# EasyEDA Pro project ProProject_P1_2024-06-12.epro, board PCB4
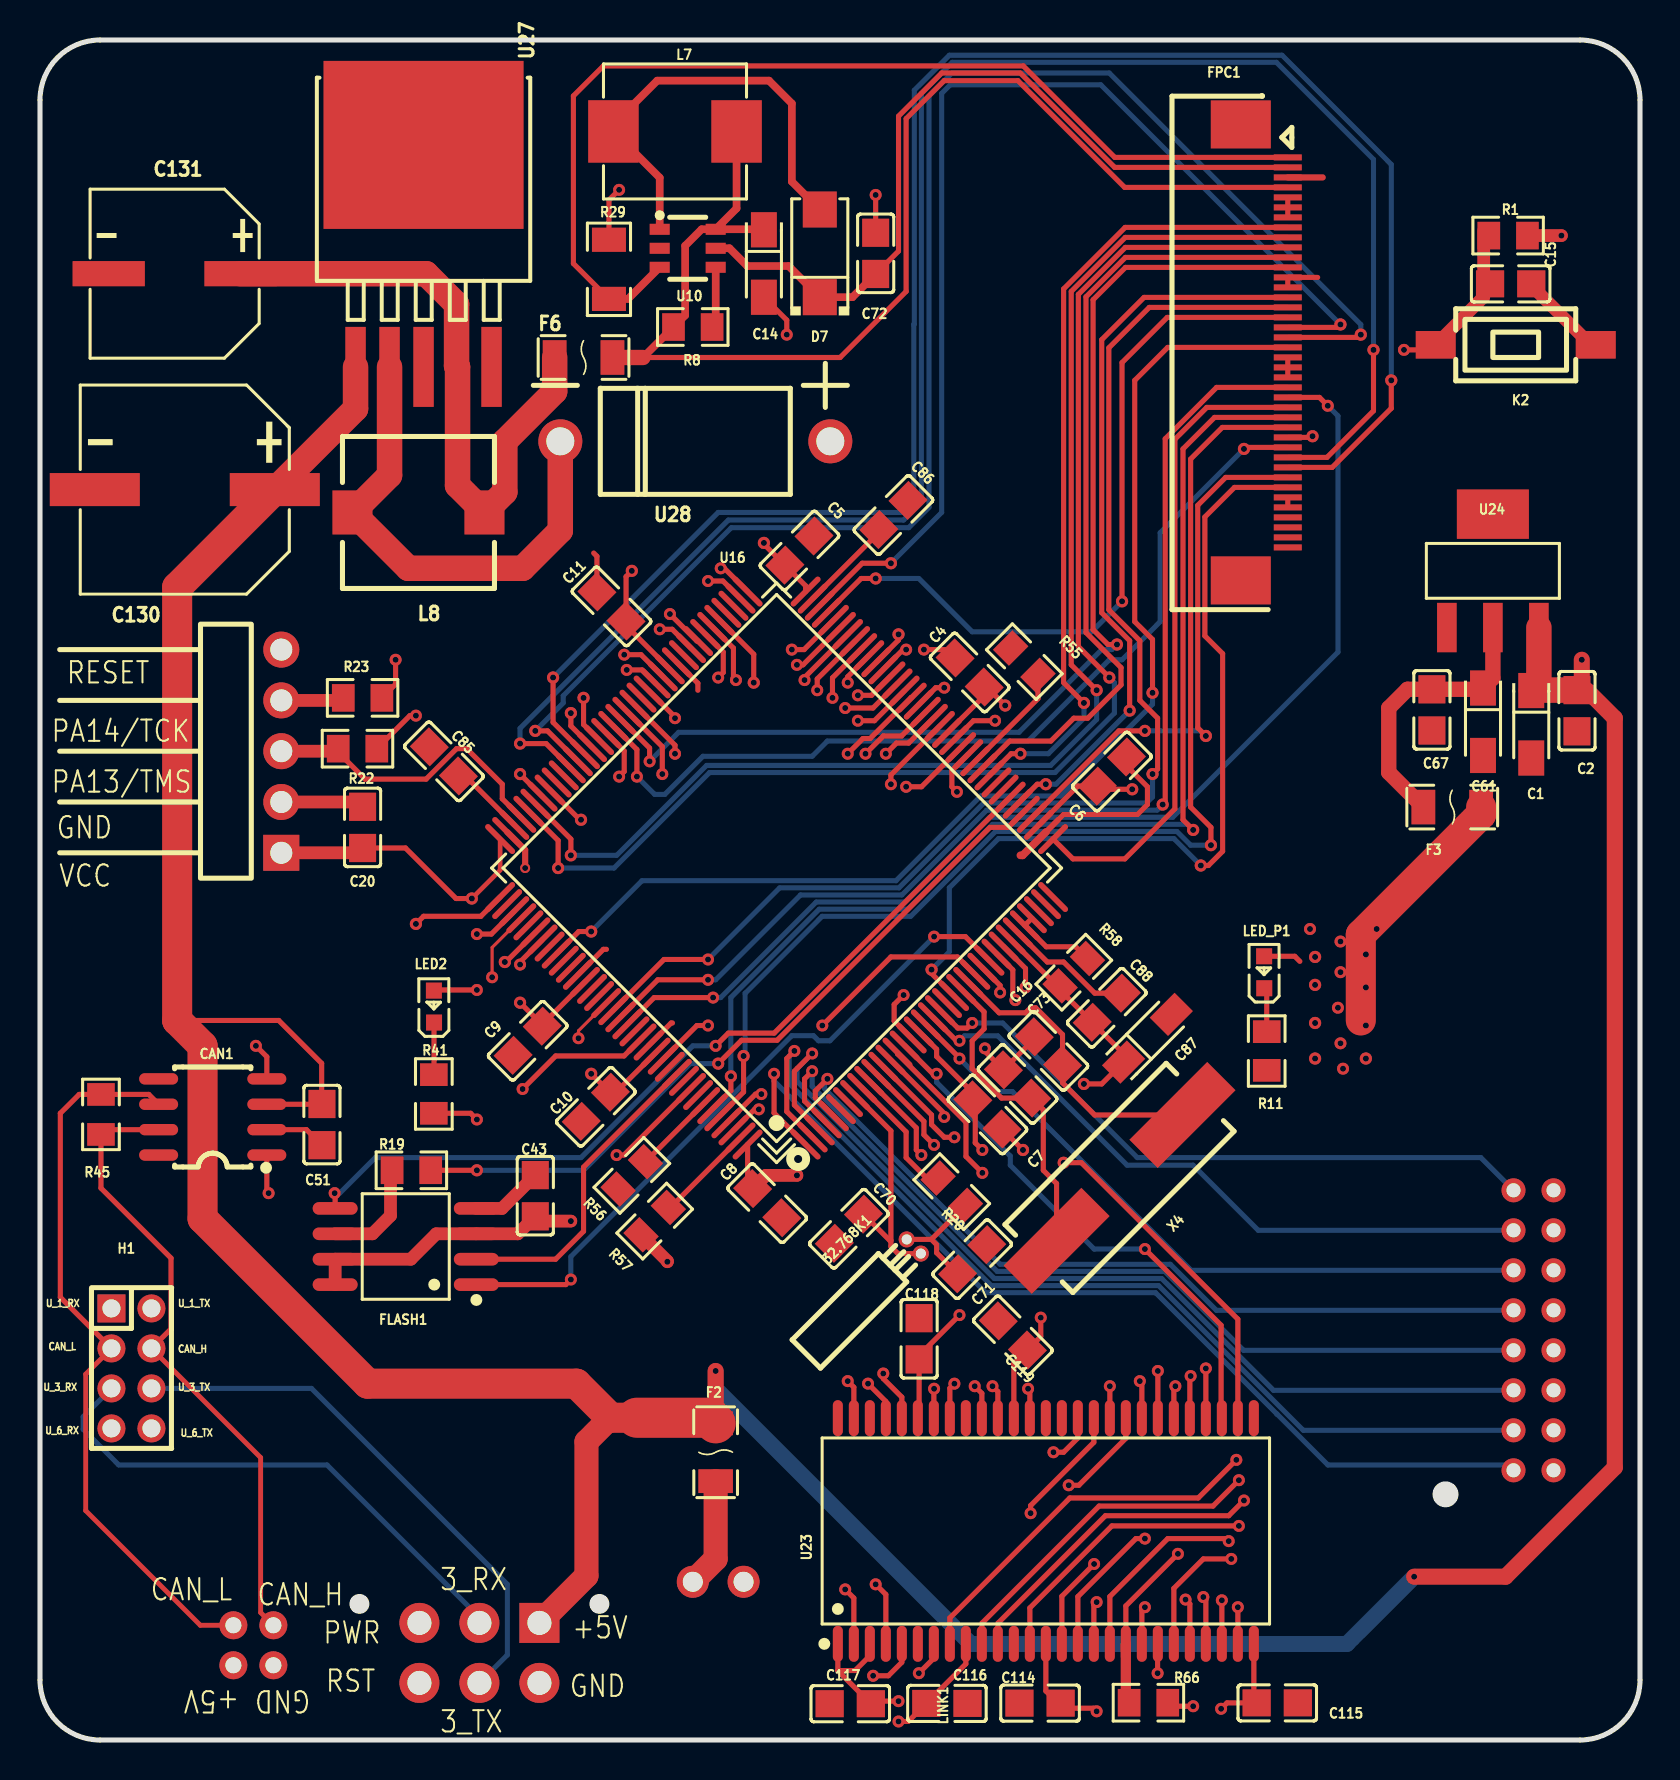
[diagram p3: board, top side]
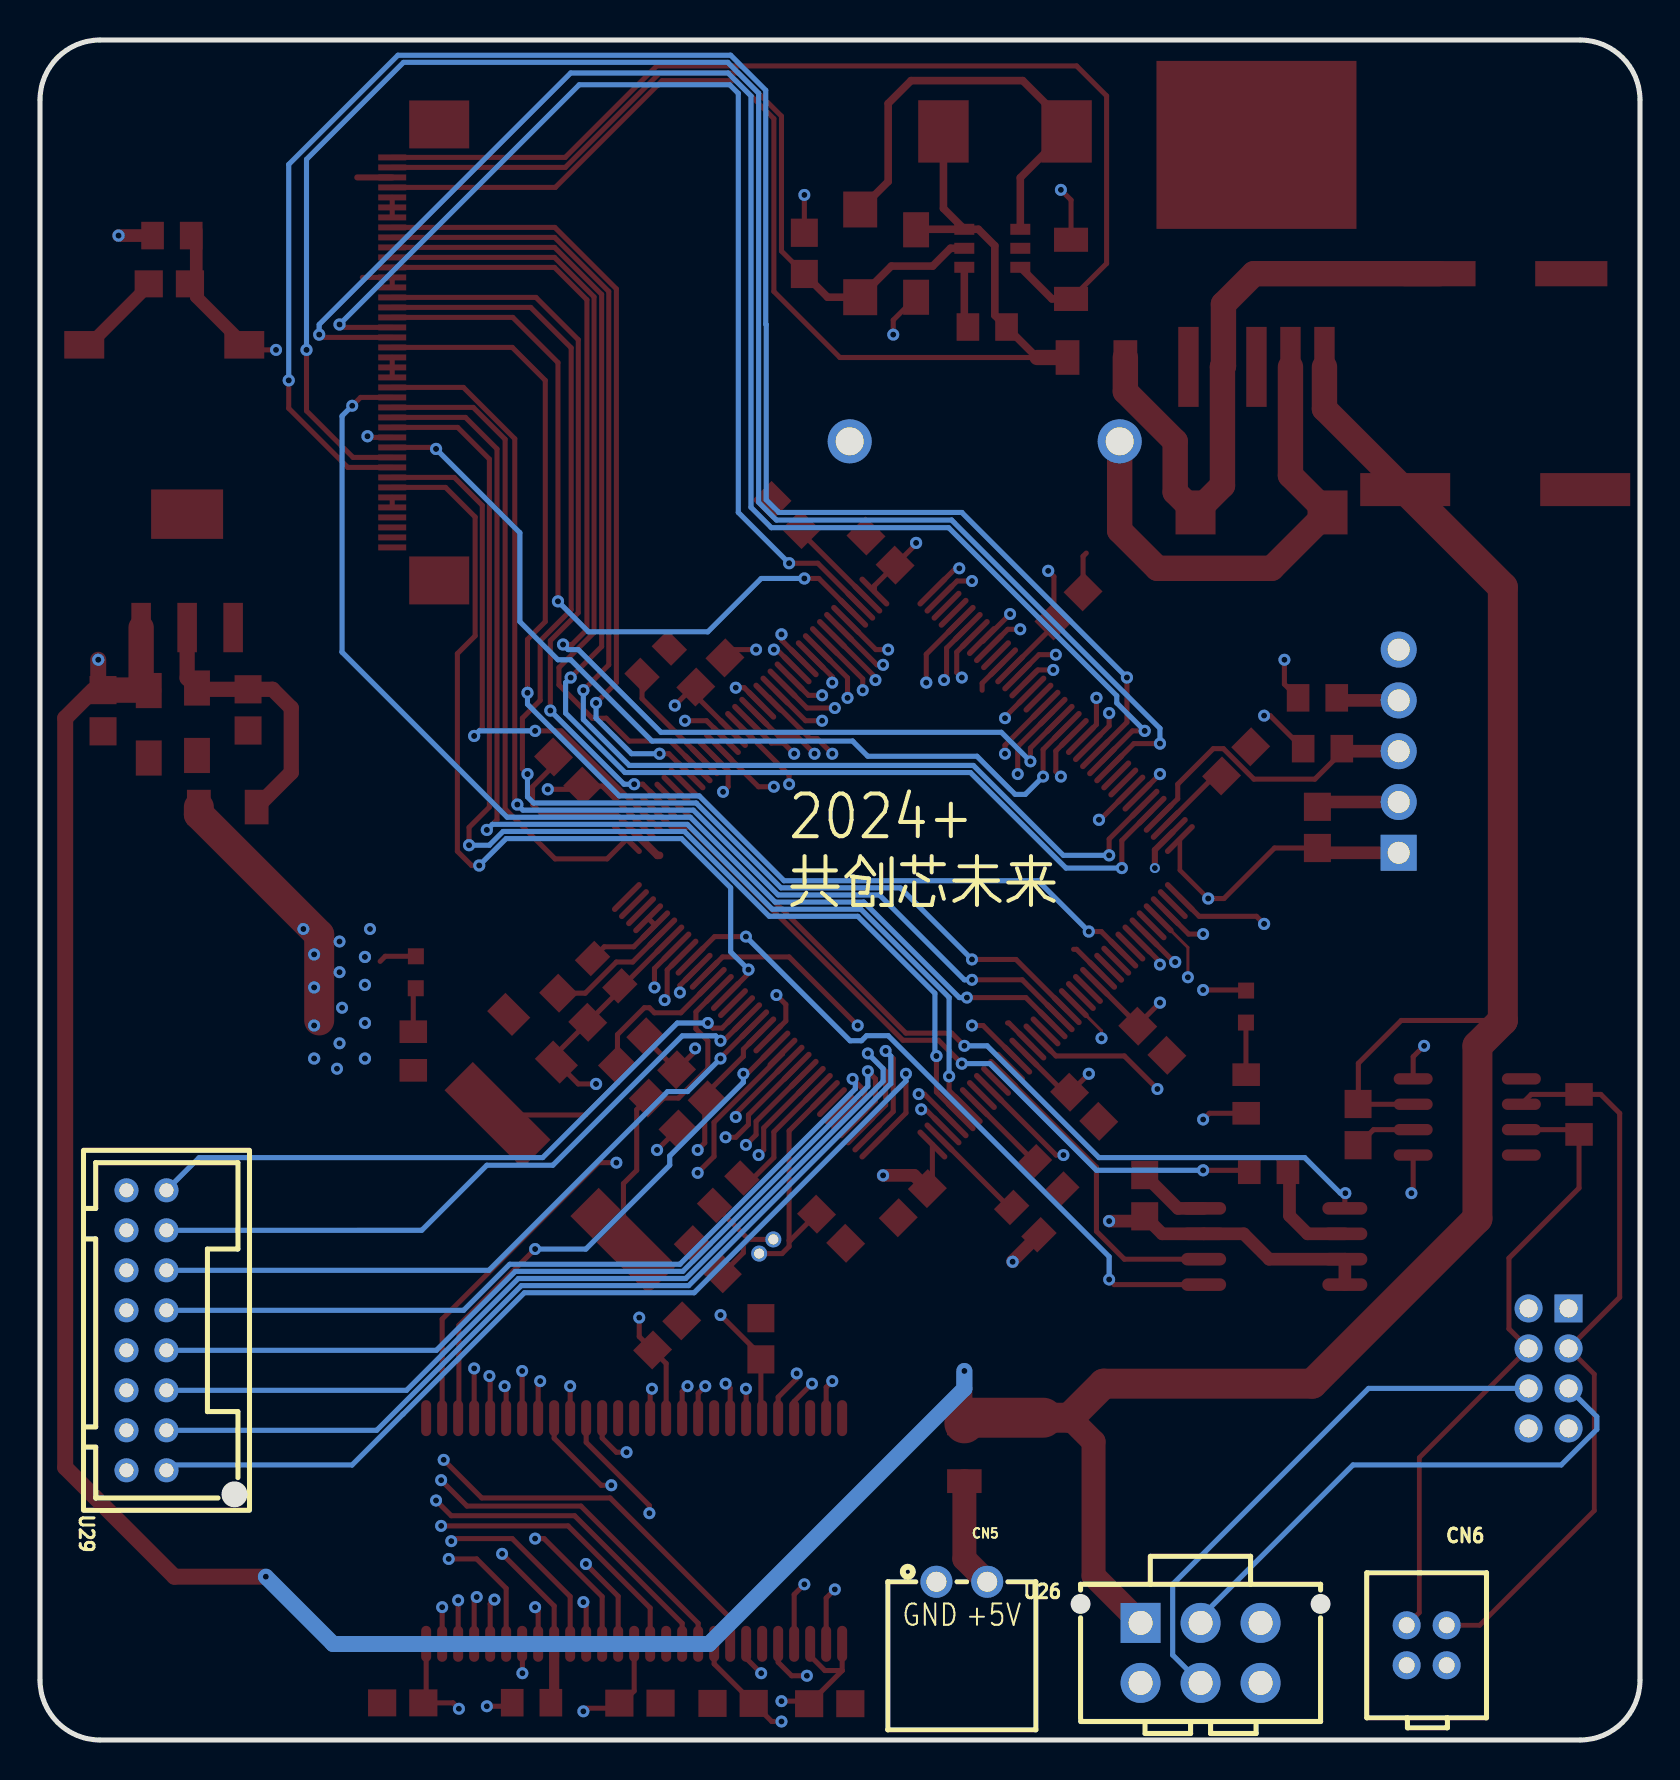
[diagram p4: board, bottom side, seen from below]

Outline 80 x 85 mm; copper layers: Top Layer, Inner1, Inner2, Bottom Layer. Coordinates in mm from the lower left corner of the outline.
Outline path: 0,82 0,3 arc(0.88,0.88) 3,0 77,0 arc(79.12,0.88) 80,3 80,82 arc(79.12,84.12) 77,85 3,85 arc(0.88,84.12) 0,82
Stack: Top Layer 0.035mm 外层铜厚1oz / Dielectric1 0.2104mm 7628 RC49% 8.6mil / Inner1 0.0152mm 内层铜厚 / Dielectric2 1.065mm 1.1mm H/HOZ 含铜 / Inner2 0.0152mm 内层铜厚 / Dielectric3 0.2104mm 7628 RC49% 8.6mil / Bottom Layer 0.035mm 外层铜厚1oz

## Design rules (mm)
template: JLCPCB Capability(Two Layers Board)
spacing copperThickness1oz (default): track to track 0.102, other pairs 0.152 to 0.3
spacing copperThickness2oz: track to track 0.203, other pairs 0.152 to 0.3
track width copperThickness1oz (default): min 0.127, default 0.254, max 2.54
track width copperThickness2oz: min 0.203, default 0.254, max 2.54
differential pair differentialPair (default): width min 0.127, default 0.254, max 2.54; gap min 0.152, default 0.152
via viaSize (default): diameter min 0.5, default 0.61, max 10; hole min 0.3, default 0.305, max 6.3

## Placement (name value [footprint] x y rotation side)
32.768K1  32.768kHz  [OSC-TH_BD2.0-P0.70-D0.3]  43.69 24.67 45 top
C1  10uF  [CAP-SMD_L3.2-W1.6-RD]  74.56 50.79 270 top
C2  100nF  [C0805]  76.85 51.46 90 top
C4  100nF  [C0805]  46.48 53.38 315 top
C5  100nF  [C0805]  37.97 59.47 225 top
C6  100nF  [C0805]  53.59 48.42 225 top
C7  100nF  [C0805]  47.37 31.28 135 top
C8  100nF  [C0805]  36.36 26.84 135 top
C9  100nF  [C0805]  24.38 34.96 45 top
C10  100nF  [C0805]  27.79 31.66 45 top
C11  100nF  [C0805]  28.58 56.68 315 top
C14  10uF  [CAP-SMD_L3.2-W1.6-RD]  36.19 73.82 270 top
C15  100nF  [C0805]  73.53 72.81 180 top
C16  22pF  [c0805#2]  50.42 34.45 135 top
C20  100nF  [C0805]  16.13 45.63 90 top
C43  100nF  [C0805]  24.77 27.22 90 top
C51  100nF  [C0805]  14.1 30.77 270 top
C61  10uF  [CAP-SMD_L3.2-W1.6-RD]  72.15 50.91 270 top
C67  100nF  [C0805]  69.6 51.51 90 top
C70  12pF  [C0805]  40.45 25.56 225 top
C71  12pF  [C0805]  46.61 24.04 45 top
C72  1uF  [C0805]  41.78 74.33 90 top
C73  22pF  [C0805#2]  48.88 32.8 135 top
C85  22uF  [C0805]  20.19 48.93 135 top
C86  22uF  [C0805]  42.67 61.25 45 top
C87  10uF  [CAP-SMD_L3.2-W1.6-RD]  55.37 35.09 45 top
C88  100nF  [C0805]  53.34 36.61 225 top
C114  100nF  [C0805]  50 1.84 0 top
C115  100nF  [C0805]  61.86 1.86 180 top
C116  100nF  [c0805]  45.35 1.83 180 top
C117  100nF  [C0805]  40.51 1.81 0 top
C118  100nF  [C0805]  43.96 20.06 270 top
C119  100nF  [C0805]  48.64 20.23 315 top
C130  680uF  [CAP-SMD_BD10.0-L10.3-W10.3-LS10.9-FD]  7.24 62.52 180 top
C131  220uF  [CAP-SMD_BD8.0-L8.3-W8.3-RD]  6.73 73.32 0 top
CAN1  TJA1050T/CM,118  [soic-8_l5.0-w4.0-p1.27-ls6.0-bl]  8.64 31.15 90 top
CN5  XH-2AW  [CONN-TH_XH-2AW_C2908611]  33.91 7.91 180 bottom
CN6  PHB-2*2A  [CONN-TH_PHB-2-2A]  10.67 4.74 180 bottom
D7  SS16  [SMA_L4.4-W2.6-LS5.0-RD]  38.99 74.33 90 top
F2  BSMD1206-200-12V  [F1206]  33.78 14.39 90 top
F3  BSMD1206-100-24V  [F1206]  70.61 46.65 0 top
F6  BSMD1206-100-24V  [F1206]  27.18 69.12 0 top
FLASH1  W25Q128JVSIQ  [SOIC-8_L5.3-W5.3-P1.27-LS8.0-BL]  18.29 24.67 90 top
FPC1  F0501-B-40-20T-R  [FPC-SMD_40P-P0.50_L4.4-W25.6]  61.21 69.38 270 top
H1  PZ200-2-04-Z  [HDR-TH_8P-P2.00-V-M-R2-C4-S2.00]  4.57 18.58 270 top
K2  RESET_KEY  [SW-SMD_L6.1-W3.6-LS8.0]  73.79 69.76 0 top
L7  22uH  [IND-SMD_L7.3-W6.6_MHCI06030]  31.75 80.43 0 top
L8  10uH  [IND-SMD_L7.6-W7.6]  18.92 61.38 180 top
LED2  NCD0603W1  [LED0603-RD]  19.7 36.67 90 top
LED_P1  NCD0603W1  [LED0603-RD]  61.21 38.39 90 top
LINK1  五线下载电路  [HDR-TH_5P-P2.54-H-M-W10.0-N]  12.07 49.44 90 top
R1  10kΩ  [R0805]  73.41 75.22 0 top
R8  10kΩ  [R0805]  32.64 70.65 0 top
R11  510  [R0805]  61.34 34.45 270 top
R19  22R  [R0805]  18.57 28.48 0 top
R20  1kΩ  [R0805]  45.59 27.42 135 top
R22  10kΩ  [R0805]  15.88 49.57 180 top
R23  10kΩ  [R0805]  16.13 52.11 180 top
R29  7.5Ω  [R1206]  28.45 73.53 270 top
R41  510  [R0805]  19.69 32.3 270 top
R45  120Ω  [R0805#2]  3.05 31.28 270 top
R55  10kΩ  [R0805]  49.22 53.92 315 top
R56  10kΩ  [R0805]  29.59 28.23 225 top
R57  0Ω  [R0805]  30.73 25.94 45 top
R58  0Ω  [R0805]  51.69 38.39 45 top
R66  10kΩ  [R0805]  55.42 1.87 180 top
U10  -  [SOT-23-6_L2.9-W1.6-P0.95-LS2.8-BR]  32.39 74.59 180 top
U16  STM32F429ZGT6  [LQFP-144_L20.0-W20.0-P0.50-LS22.0-BL]  36.83 43.6 45 top
U23  W9825G6KH-6  [TSOP-54_L22.2-W10.2-P0.80-LS11.8-BL]  50.29 10.45 0 top
U24  AMS1117-3.3  [SOT-223-4_L6.5-W3.5-P2.30-LS7.0-BR]  72.64 58.46 270 top
U26  ZX-MX3.0-2-3PZZ  [CONN-TH_6P-P3.00_HC-MX3.0-2X3A]  21.97 4.35 180 bottom
U27  LM2575S-3.3  [TO-263-5_L10.0-W8.4-P1.70-LS15.3-BR]  19.18 74.2 270 top
U28  1N5824  [DO-201AD_BD5.3-L9.5-P13.50-D1.4-RD]  32.77 64.93 0 top
U29  B16B-PUDSS-1(LF)(SN)  [CONN-TH_B16B-PUDSS-1]  74.68 20.48 90 bottom
X4  8MHz  [CRYSTAL-SMD_L11.5-W4.8-LS12.7]  53.97 28.1 45 top

## Footprints (pads in the part's own frame, mm; a bottom-side part is the same pattern mirrored in y, then rotated)
c0805
  rect 1.41x1.35 smd: 1(-1.03,0) 2(1.03,0)
c0805#2
  rect 1.41x1.35 smd: 1(-1,0) 2(1,0)
C0805
  rect 1.41x1.35 smd: 1(-1.03,0) 2(1.03,0)
C0805#2
  rect 1.41x1.35 smd: 1(-1,0) 2(1,0)
CAP-SMD_BD8.0-L8.3-W8.3-RD
  rect 3.61x1.26 smd: 1(3.295,0) 2(-3.295,0)
CAP-SMD_BD10.0-L10.3-W10.3-LS10.9-FD
  rect 4.5x1.65 smd: 1(-4.5,0) 2(4.5,0)
CAP-SMD_L3.2-W1.6-RD
  rect 1.758x1.296 smd: 1(-1.687,0) 2(1.687,0)
CONN-TH_6P-P3.00_HC-MX3.0-2X3A
  rect 2x2 hole 1.2: 1(-3,1.5)
  round 2 hole 1.2: 2(-3,-1.5) 3(0,1.5) 4(0,-1.5) 5(3,1.5) 6(3,-1.5)
CONN-TH_B16B-PUDSS-1
  round 1.2 hole 0.7: 1(7,-1) 2(7,1) 3(5,-1) 4(5,1) 5(3,-1) 6(3,1) 7(1,-1) 8(1,1) 9(-1,-1) 10(-1,1) 11(-3,-1) 12(-3,1) 13(-5,-1) 14(-5,1) 15(-7,-1) 16(-7,1)
CONN-TH_PHB-2-2A
  round 1.4 hole 0.8: 1(1,-1) 2(1,1) 3(-1,-1) 4(-1,1)
CONN-TH_XH-2AW_C2908611
  round 1.6 hole 1: 1(-1.27,0) 2(1.27,0)
CRYSTAL-SMD_L11.5-W4.8-LS12.7
  rect 5.499x1.999 smd: 1(-4.45,0) 2(4.45,0)
DO-201AD_BD5.3-L9.5-P13.50-D1.4-RD
  round 2.2 hole 1.4: 1(-6.75,0) 2(6.75,0)
F1206
  rect 1.19x1.728 smd: 1(-1.445,0) 2(1.445,0)
FPC-SMD_40P-P0.50_L4.4-W25.6
  rect 2.4x3 smd: 0(-11.4,-1.175) 0(11.4,-1.175)
  rect 0.3x1.4 smd: 1(-9.75,1.175) 2(-9.25,1.175) 3(-8.75,1.175) 4(-8.25,1.175) 5(-7.75,1.175) 6(-7.25,1.175) 7(-6.75,1.175) 8(-6.25,1.175) 9(-5.75,1.175) 10(-5.25,1.175) 11(-4.75,1.175) 12(-4.25,1.175) 13(-3.75,1.175) 14(-3.25,1.175) 15(-2.75,1.175) 16(-2.25,1.175) 17(-1.75,1.175) 18(-1.25,1.175) 19(-0.75,1.175) 20(-0.25,1.175) 21(0.25,1.175) 22(0.75,1.175) 23(1.25,1.175) 24(1.75,1.175) 25(2.25,1.175) 26(2.75,1.175) 27(3.25,1.175) 28(3.75,1.175) 29(4.25,1.175) 30(4.75,1.175) 31(5.25,1.175) 32(5.75,1.175) 33(6.25,1.175) 34(6.75,1.175) 35(7.25,1.175) 36(7.75,1.175) 37(8.25,1.175) 38(8.75,1.175) 39(9.25,1.175) 40(9.75,1.175)
HDR-TH_5P-P2.54-H-M-W10.0-N
  rect 1.8x1.8 hole 1.1: 1(-5.08,0)
  round 1.8 hole 1.1: 2(-2.54,0) 3(0,0) 4(2.54,0) 5(5.08,0)
HDR-TH_8P-P2.00-V-M-R2-C4-S2.00
  rect 1.4x1.4 hole 0.9: 1(-3,-1)
  round 1.4 hole 0.9: 2(-3,1) 3(-1,-1) 4(-1,1) 5(1,-1) 6(1,1) 7(3,-1) 8(3,1)
IND-SMD_L7.3-W6.6_MHCI06030
  rect 2.524x3.12 smd: 1(-3.078,0) 2(3.078,0)
IND-SMD_L7.6-W7.6
  rect 2x2.2 smd: 1(-3.3,0) 2(3.3,0)
LED0603-RD
  rect 0.8x0.8 smd: 1(-0.799,-0.004) 2(0.799,0.004)
LQFP-144_L20.0-W20.0-P0.50-LS22.0-BL
  oval 0.28x2 smd: 1(-8.75,-10.8) 2(-8.25,-10.8) 3(-7.75,-10.8) 4(-7.25,-10.8) 5(-6.75,-10.8) 6(-6.25,-10.8) 7(-5.75,-10.8) 8(-5.25,-10.8) 9(-4.75,-10.8) 10(-4.25,-10.8) 11(-3.75,-10.8) 12(-3.25,-10.8) 13(-2.75,-10.8) 14(-2.25,-10.8) 15(-1.75,-10.8) 16(-1.25,-10.8) 17(-0.75,-10.8) 18(-0.25,-10.8) 19(0.25,-10.8) 20(0.75,-10.8) 21(1.25,-10.8) 22(1.75,-10.8) 23(2.25,-10.8) 24(2.75,-10.8) 25(3.25,-10.8) 26(3.75,-10.8) 27(4.25,-10.8) 28(4.75,-10.8) 29(5.25,-10.8) 30(5.75,-10.8) 31(6.25,-10.8) 32(6.75,-10.8) 33(7.25,-10.8) 34(7.75,-10.8) 35(8.25,-10.8) 36(8.75,-10.8) 73(8.75,10.8) 74(8.25,10.8) 75(7.75,10.8) 76(7.25,10.8) 77(6.75,10.8) 78(6.25,10.8) 79(5.75,10.8) 80(5.25,10.8) 81(4.75,10.8) 82(4.25,10.8) 83(3.75,10.8) 84(3.25,10.8) 85(2.75,10.8) 86(2.25,10.8) 87(1.75,10.8) 88(1.25,10.8) 89(0.75,10.8) 90(0.25,10.8) 91(-0.25,10.8) 92(-0.75,10.8) 93(-1.25,10.8) 94(-1.75,10.8) 95(-2.25,10.8) 96(-2.75,10.8) 97(-3.25,10.8) 98(-3.75,10.8) 99(-4.25,10.8) 100(-4.75,10.8) 101(-5.25,10.8) 102(-5.75,10.8) 103(-6.25,10.8) 104(-6.75,10.8) 105(-7.25,10.8) 106(-7.75,10.8) 107(-8.25,10.8) 108(-8.75,10.8)
  oval 2x0.28 smd: 37(10.8,-8.75) 38(10.8,-8.25) 39(10.8,-7.75) 40(10.8,-7.25) 41(10.8,-6.75) 42(10.8,-6.25) 43(10.8,-5.75) 44(10.8,-5.25) 45(10.8,-4.75) 46(10.8,-4.25) 47(10.8,-3.75) 48(10.8,-3.25) 49(10.8,-2.75) 50(10.8,-2.25) 51(10.8,-1.75) 52(10.8,-1.25) 53(10.8,-0.75) 54(10.8,-0.25) 55(10.8,0.25) 56(10.8,0.75) 57(10.8,1.25) 58(10.8,1.75) 59(10.8,2.25) 60(10.8,2.75) 61(10.8,3.25) 62(10.8,3.75) 63(10.8,4.25) 64(10.8,4.75) 65(10.8,5.25) 66(10.8,5.75) 67(10.8,6.25) 68(10.8,6.75) 69(10.8,7.25) 70(10.8,7.75) 71(10.8,8.25) 72(10.8,8.75) 109(-10.8,8.75) 110(-10.8,8.25) 111(-10.8,7.75) 112(-10.8,7.25) 113(-10.8,6.75) 114(-10.8,6.25) 115(-10.8,5.75) 116(-10.8,5.25) 117(-10.8,4.75) 118(-10.8,4.25) 119(-10.8,3.75) 120(-10.8,3.25) 121(-10.8,2.75) 122(-10.8,2.25) 123(-10.8,1.75) 124(-10.8,1.25) 125(-10.8,0.75) 126(-10.8,0.25) 127(-10.8,-0.25) 128(-10.8,-0.75) 129(-10.8,-1.25) 130(-10.8,-1.75) 131(-10.8,-2.25) 132(-10.8,-2.75) 133(-10.8,-3.25) 134(-10.8,-3.75) 135(-10.8,-4.25) 136(-10.8,-4.75) 137(-10.8,-5.25) 138(-10.8,-5.75) 139(-10.8,-6.25) 140(-10.8,-6.75) 141(-10.8,-7.25) 142(-10.8,-7.75) 143(-10.8,-8.25) 144(-10.8,-8.75)
OSC-TH_BD2.0-P0.70-D0.3
  round 0.8 hole 0.5: 1(0,0.5) 2(0,-0.5)
R0805
  rect 1.133x1.377 smd: 1(-0.966,0) 2(0.966,0)
R0805#2
  rect 1.133x1.377 smd: 1(-1,0) 2(1,0)
R1206
  rect 1.208x1.701 smd: 1(-1.479,0) 2(1.479,0)
SMA_L4.4-W2.6-LS5.0-RD
  rect 1.8x1.7 smd: 1(-2.192,0) 2(2.192,0)
soic-8_l5.0-w4.0-p1.27-ls6.0-bl
  oval 0.569x1.95 smd: 1(-1.905,-2.705) 2(-0.635,-2.705) 3(0.635,-2.705) 4(1.905,-2.705) 5(1.905,2.705) 6(0.635,2.705) 7(-0.635,2.705) 8(-1.905,2.705)
SOIC-8_L5.3-W5.3-P1.27-LS8.0-BL
  oval 0.63x2.25 smd: 1(-1.905,-3.53) 2(-0.635,-3.53) 3(0.635,-3.53) 4(1.905,-3.53) 5(1.905,3.53) 6(0.635,3.53) 7(-0.635,3.53) 8(-1.905,3.53)
SOT-23-6_L2.9-W1.6-P0.95-LS2.8-BR
  rect 1x0.55 smd: 1(1.4,-0.95) 2(1.4,0) 3(1.4,0.95) 4(-1.4,0.95) 5(-1.4,0) 6(-1.4,-0.95)
SOT-223-4_L6.5-W3.5-P2.30-LS7.0-BR
  rect 2.47x0.98 smd: 1(2.835,-2.3) 2(2.835,0) 3(2.835,2.3)
  rect 2.47x3.6 smd: 4(-2.835,0)
SW-SMD_L6.1-W3.6-LS8.0
  rect 1.999x1.379 smd: 1(-4,0) 2(4,0)
TO-263-5_L10.0-W8.4-P1.70-LS15.3-BR
  rect 4x1.02 smd: 1(5.55,-3.4) 2(5.55,-1.7) 3(5.55,0) 4(5.55,1.7) 5(5.55,3.4)
  rect 8.4x10 smd: 6(-5.55,0)
TSOP-54_L22.2-W10.2-P0.80-LS11.8-BL
  oval 0.5x1.8 smd: 1(-10.4,-5.642) 2(-9.6,-5.642) 3(-8.8,-5.642) 4(-8,-5.642) 5(-7.2,-5.642) 6(-6.4,-5.642) 7(-5.6,-5.642) 8(-4.8,-5.642) 9(-4,-5.642) 10(-3.2,-5.642) 11(-2.4,-5.642) 12(-1.6,-5.642) 13(-0.8,-5.642) 14(0,-5.642) 15(0.8,-5.642) 16(1.6,-5.642) 17(2.4,-5.642) 18(3.2,-5.642) 19(4,-5.642) 20(4.8,-5.642) 21(5.6,-5.642) 22(6.4,-5.642) 23(7.2,-5.642) 24(8,-5.642) 25(8.8,-5.642) 26(9.6,-5.642) 27(10.4,-5.642) 28(10.4,5.642) 29(9.6,5.642) 30(8.8,5.642) 31(8,5.642) 32(7.2,5.642) 33(6.4,5.642) 34(5.6,5.642) 35(4.8,5.642) 36(4,5.642) 37(3.2,5.642) 38(2.4,5.642) 39(1.6,5.642) 40(0.8,5.642) 41(0,5.642) 42(-0.8,5.642) 43(-1.6,5.642) 44(-2.4,5.642) 45(-3.2,5.642) 46(-4,5.642) 47(-4.8,5.642) 48(-5.6,5.642) 49(-6.4,5.642) 50(-7.2,5.642) 51(-8,5.642) 52(-8.8,5.642) 53(-9.6,5.642) 54(-10.4,5.642)

## Nets
As in the schematic.

Pads without a net: CAN1 5; U16 6 7 21 34 35 36 44 45 75 76 82 88 99 100 110 113 116 118 119 122 123 128 133 135 137; U23 40; U24 4

## Via types
v1: diameter 0.6, hole 0.3, Top Layer to Bottom Layer, 136 vias
v2: diameter 0.61, hole 0.305, Top Layer to Bottom Layer, 65 vias
v3: diameter 0.5, hole 0.3, Top Layer to Bottom Layer, 1 via

## Routing (per net, layer and track width the routed paths; a pad name or vN(x,y) marks a point on that pad's centre or on a via; arc(x,y) is an arc through that point)
+5V: length 232.4
  Top Layer w0.254: CAN1.3 14.08,31.79 ; 14.08,31.79 14.08,33.83 11.94,35.98 6.89,35.98 6.87,35.96 ; 14.08,31.79 C51.1
  Top Layer w0.8: v1(68.71,8.16) 73.28,8.16 78.74,13.63 78.74,51.09 77.34,52.49 ; C2.2 77.09,52.73 v2(77.09,54.01) ; v1(33.78,18.45) F2.2
  Top Layer w1.2: 28.52,16.11 27.32,14.91 27.32,8.21 U26.1
  Top Layer w1.27: C2.2 74.94,52.49 ; 74.94,52.49 74.94,52.5 U24.3 ; 74.94,52.49 74.58,52.49 C1.1 ; C130.1 15.78,66.56 U27.1
  Top Layer w1.5: C130.1 6.86,57.64 6.86,35.98 8.13,34.71 8.13,26.07 16.38,17.82 26.82,17.82 28.52,16.11 29.84,16.11
  Top Layer w2: 29.84,16.11 33.5,16.11 F2.2
  Inner2 w1: CN6.1 8.87,3.74 7.75,4.86 7.75,9.56 9.4,11.21 19.61,11.21 U26.1
  Bottom Layer w0.8: v1(68.71,8.16) 65.34,4.8 46.54,4.8 33.78,17.56 v1(33.78,18.45)
GND: length 72.2
  Top Layer w0.254: v1(47.24,34.58) 47.24,34.44 48.17,33.51 49.71,35.05 49.71,35.16 ; C6.1 54.32,48.71 55.37,47.66 55.37,46.77 54.88,46.28 51.18,46.28 U16.38 ; v2(49.15,29.5) C7.1 ; U16.83 32.89,52.84 32.89,52.49 ; FPC1.21 FPC1.22 FPC1.23 ; v1(47.75,50.96) 46.67,50.96 U16.51 ; FPC1.14 62.39,73.08 62.41,73.1 FPC1.13 63.88,73.13 ; U16.120 28.17,39.53 28.32,39.53 ; v1(43.18,37.25) 42.71,36.78 42.71,35.95 U16.16 ; v2(27.18,52.11) 27.18,50.78 U16.94 ; U16.61 43.16,54.52 v1(43.31,54.52) ; 41.66,77.25 41.78,77.13 C72.2 ; v1(28.96,77.51) 28.45,77 R29.1 ; FPC1.5 FPC1.6 FPC1.7 ; C88.1 52.74,37.34 51.18,38.9 50.37,38.9 48.89,40.38 ; C14.2 37.34,70.99 v1(37.34,70.27) ; FPC1.35 FPC1.36 ; v1(44.2,54.52) 45.34,54.52 C4.1 ; v2(63.63,65.19) 63.57,65.13 FPC1.29 ; CAN1.2 13.32,30.52 C51.2 ; C11.1 27.85,59.19 27.69,59.35 ; 31.62,35.85 31.56,35.85 U16.130
  Top Layer w0.305: FPC1.3 64.14,78.13 ; v3(24.26,43.6) 24.26,44.5 U16.107
  Top Layer w0.381: 49.02,44.23 49.13,44.23 U16.38
  Top Layer w0.635: 77.66,69.63 74.56,72.73 C15.1 ; C43.2 23.1,26.58 FLASH1.4 ; C20.2 15.89,46.9 LINK1.2
  vias: v1(41.78,77.25)
VCC: length 185.8
  Top Layer w0.229: 23.01,45.05 23.01,43.49 v2(21.59,42.07)
  Top Layer w0.254: U23.27 60.69,2.12 60.96,1.86 59.35,1.86 v1(59.06,1.56) ; v1(18.8,51.22) 18.49,51.22 R22.1 ; v2(26.54,51.34) 26.54,50.7 27.6,49.64 ; U23.1 39.89,3.47 ; 39.89,3.47 40.76,3.47 41.49,4.21 41.49,4.81 ; 39.89,3.47 39.89,3.47 C117.2 41.67,1.94 v1(42.93,1.94) ; R23.1 17.78,52.79 v1(17.78,54.01) ; 29.18,55.63 29.12,55.57 29.12,55.44 ; 29.18,55.63 29.3,55.76 C11.2 29.3,58.17 v2(29.59,58.46) ; 29.18,55.63 29.18,55.5 29.12,55.44 ; v2(27.56,33.31) 28.42,32.45 28.74,32.45 ; v1(57.66,1.69) 56.89,1.69 56.71,1.87 R66.1 ; U16.121 25.09,35.75 ; 25.09,35.75 25.11,35.73 C9.2 ; 25.09,35.75 25.09,35.78 v2(24,36.87) ; 28.74,32.45 28.86,32.45 30.78,34.37 ; 28.74,32.45 28.74,32.39 C10.2 ; U16.72 38.28,57.71 C5.2 36.19,59.79 v2(36.19,59.85) ; LED2.2 19.73,37.5 v1(21.84,37.5) ; U16.17 44.83,34.54 44.83,34.18 46.76,32.25 46.76,29.86 v1(47.12,29.5) ; U16.62 42.93,55 v2(42.93,55.28) ; U23.43 48.69,18.82 C119.2 50.04,20.17 v1(50.04,21.12) ; U16.39 51.89,47.7 C6.2 53.03,47.53 v2(54.61,47.53) ; U16.84 29.58,55.44 29.12,55.44 ; v1(45.97,21.25) 43.96,19.23 C118.2 43.96,16.16 U23.49 ; U16.52 47.21,52.21 C4.2 47.34,52.65 v2(48.26,51.73) ; U23.14 50.29,2.45 51.15,1.59 52.68,1.59 v1(52.83,1.43) ; U23.9 46.29,3.81 C116.2 43.41,0.93 v1(42.93,0.93) ; v2(52.2,32.8) 53.09,32.8 C87.1 54.18,34.32 C88.2 51.01,37.49 51.01,37.71 50.85,37.71 U16.30 ; C20.1 18.27,44.6 20.8,42.07 v2(21.59,42.07) ; 35.38,29.77 35.38,27.82 35.63,27.57 ; 62.99,38.93 62.74,39.19 LED_P1.2
  Top Layer w0.635: 35.63,27.57 36.29,28.23 v2(37.85,28.23) ; R57.1 31.37,23.94 v2(31.37,23.91) ; FLASH1.8 FLASH1.7 18.54,24.04 19.81,25.31 FLASH1.3 23.89,25.31 C43.1 25,25.94 v2(26.54,25.94) ; LINK1.1 15.89,44.36 C20.1 ; v2(76.07,75.22) R1.2
  Top Layer w1.5: 66.04,35.98 66.04,40.27 72.06,46.29 F3.2
  Inner2 w0.254: 67.31,39.79 76.07,48.55 v2(76.07,75.22)
  vias: v1(63.5,40.55) v1(64.9,36.61) v1(65.02,39.92) v1(65.02,38.39) v1(65.02,34.83) v1(65.15,33.56) v1(66.83,40.55) v2(63.75,39.15) v2(63.75,37.76) v2(63.75,35.85) v2(63.75,34.07) v2(66.29,39.28) v2(66.29,37.63) v2(66.29,35.72) v2(66.29,34.07)
VCC_LCD: length 62.8
  Top Layer w0.254: FPC1.4 54.23,77.63 48.9,82.97 45.21,82.97 43.31,81.07 43.31,72.43 40,69.12 30.15,69.12
  Top Layer w0.381: U10.6 36.17,75.54 C14.1 ; U10.6 34.83,76.58 L7.2 ; U10.6 33.08,75.54 32.26,74.71 32.26,71.23 R8.1 30.15,69.12
  Top Layer w0.762: F6.2 30.15,69.12
VDDA: length 4.3
  Top Layer w0.254: U16.33 49.24,40.73 50.31,39.66 51.79,39.66 52.37,39.07
CAN2_RX: length 40
  Top Layer w0.254: v1(10.8,34.71) 11.34,34.16 CAN1.4 ; U16.73 34.22,58.58 v1(34.04,58.58)
  Inner1 w0.254: v1(34.04,58.58) 33.15,58.58 32,57.44 28.64,57.44 10.42,39.22 10.42,35.08 v1(10.8,34.71)
CAN2_TX: length 45.8
  Top Layer w0.254: CAN1.1 11.34,27.43 v1(11.43,27.34) ; U16.74 34.15,57.95 v1(33.4,57.95)
  Inner1 w0.254: v1(33.4,57.95) 32.33,56.88 28.58,56.88 11.43,39.73 v1(11.43,27.34)
CAN_H: length 31.9
  Top Layer w0.24: H1.4 11.03,14.12 11.03,6.37 CN6.4
  Top Layer w0.254: CAN1.7 3.29,30.52 R45.2 3.05,27.6 6.55,24.09 6.55,20.56 H1.4
CAN_L: length 36.7
  Top Layer w0.24: CN6.2 8.02,5.74 2.29,11.47 2.29,18.29 H1.3
  Top Layer w0.254: H1.3 1.02,22.14 1.02,31.34 1.96,32.28 R45.1 5.44,32.28 CAN1.6
FMC_A0: length 35.4
  Top Layer w0.254: 57.49,4.81 57.49,6.81 57.4,6.9 ; v1(44.07,29.25) 43.81,29.5 43.81,30.6 U16.10
  Inner1 w0.254: v1(44.07,29.25) 44.07,28.1 50.87,21.3 50.87,15.96 53.09,13.75 53.09,9.82 55.88,7.02 v1(57.28,7.02)
FMC_A1: length 36.4
  Top Layer w0.254: v1(44.7,29.75) 44.2,30.26 44.2,30.93 U16.11 ; U23.24 58.29,7.02 v1(58.17,7.15)
  Inner1 w0.254: v1(58.17,7.15) 57.71,7.6 55.8,7.6 53.44,9.96 53.44,13.9 51.23,16.11 51.23,21.45 44.7,27.98 v1(44.7,29.75)
FMC_A2: length 37.8
  Top Layer w0.254: 59.06,7.02 v1(59.09,6.98) U23.25 ; v1(45.72,30.14) 45.21,30.14 44.58,30.77 44.58,31.25 U16.12
  Inner1 w0.254: v1(45.72,30.14) 45.72,27.46 51.58,21.6 51.58,16.27 53.85,14.01 53.85,10.06 55.87,8.04 58.67,8.04 59.06,7.66 59.06,7.02
FMC_A3: length 38.3
  Top Layer w0.254: 42.52,34.02 45.21,31.33 v1(45.21,31.15) ; U23.26 v1(59.89,6.64)
  Inner1 w0.254: v1(45.21,31.15) 45.64,31.15 46.36,30.44 46.36,27.72 51.94,22.14 51.94,16.67 54.36,14.26 54.36,10.07 56.03,8.39 58.82,8.39 59.89,7.32 v1(59.89,6.64)
FMC_A4: length 28.9
  Top Layer w0.254: U23.29 59.89,21.04 52.07,28.87 v1(51.18,28.87) ; 42.88,34.37 42.88,34.31 46.3,30.88 46.3,29.18 v1(47.12,28.36)
  Inner1 w0.254: v1(47.12,28.36) 50.67,28.36 v1(51.18,28.87)
FMC_A5: length 26.8
  Top Layer w0.254: v1(44.83,33.31) 44.64,33.31 U16.15 ; U23.30 59.06,16.13 59.06,20.74 v1(55.25,24.55)
  Bottom Layer w0.254: v1(44.83,33.31) 44.83,32.88 48.51,29.2 48.51,28.74 52.71,24.55 v1(55.25,24.55)
FMC_A6: length 41.3
  Top Layer w0.254: v1(43.31,47.66) 44.08,47.66 46.06,49.64 ; U23.31 v1(58.29,18.58)
  Inner1 w0.254: v1(43.31,47.66) 43.31,46.57 58.29,31.58 v1(58.29,18.58)
FMC_A7: length 41.9
  Top Layer w0.254: 57.49,16.09 57.49,18.16 v1(57.53,18.2) ; U16.53 42.55,48.25 v1(42.55,47.79)
  Inner1 w0.254: v1(42.55,47.79) 42.55,46.83 57.53,31.84 v1(57.53,18.2)
FMC_A8: length 42.6
  Top Layer w0.254: v1(42.29,49.31) 42.82,49.85 43.43,49.85 U16.54 ; U23.33 56.69,17.61 v1(56.77,17.69)
  Inner1 w0.254: v1(42.29,49.31) 41.91,48.93 41.91,46.96 56.77,32.1 v1(56.77,17.69)
FMC_A9: length 43.5
  Top Layer w0.254: U16.55 43.08,50.2 42.16,50.2 v1(41.28,49.31) ; U23.34 v1(55.89,18.45)
  Inner1 w0.254: v1(55.89,18.45) 55.89,32.47 40.89,47.47 40.89,48.93 v1(41.28,49.31)
FMC_A10: length 59.5
  Top Layer w0.254: v1(45.21,52.61) 44.79,52.61 U16.56 ; U23.22 56.69,7.58 58.17,9.05 v1(59.56,9.05)
  Inner1 w0.254: v1(59.56,9.05) 59.92,9.05 61.82,10.95 61.82,31.69 46.61,46.9 46.61,51.22 v1(45.21,52.61)
FMC_A11: length 43.9
  Top Layer w0.254: v1(40.39,49.31) 41.15,50.08 41.51,50.08 43.55,52.12 U16.57 ; v1(54.99,17.94) 55.09,17.84 U23.35
  Inner1 w0.254: v1(40.39,49.31) 40.13,49.06 40.13,47.59 54.56,33.16 54.56,18.37 v1(54.99,17.94)
FMC_A12: length 58.9
  Top Layer w0.254: v1(51.44,12.74) 51.94,12.74 54.29,15.09 U23.36 ; U16.87 31.75,51.15 v1(31.75,51.09)
  Inner1 w0.254: v1(51.44,12.74) 51.05,13.12 41.53,13.12 38.35,16.29 38.35,26.07 32.77,31.66 32.77,50.08 v1(31.75,51.09)
FMC_BA0: length 65.4
  Top Layer w0.254: v1(31.75,49.31) 31.75,49.74 U16.89 ; v1(55.25,6.64) 55.09,6.49 U23.20
  Inner1 w0.254: v1(31.75,49.31) 32.41,48.65 32.41,31.51 38,25.92 38,15.63 41.02,12.61 50.22,12.61 51.44,11.4 51.44,7.02 52.32,6.13 54.74,6.13 v1(55.25,6.64)
FMC_BA1: length 67.5
  Top Layer w0.254: v1(31.12,48.3) 31.12,49.67 29.37,51.41 ; v1(55.88,3.34) 55.88,4.8 U23.21
  Inner1 w0.254: v1(31.12,48.3) 32.06,47.36 32.06,30.34 37.59,24.8 37.59,14.64 40.26,11.97 50.04,11.97 50.8,11.21 50.8,6.26 53.72,3.34 v1(55.88,3.34)
FMC_D0: length 57.6
  Top Layer w0.254: v1(29.21,54.27) 30.05,54.27 U16.85 ; U23.2 40.69,7.1 v1(40.26,7.53)
  Inner1 w0.254: v1(40.26,7.53) 36.45,11.34 36.45,24.16 28.96,31.66 28.96,46.84 27.94,47.85 27.94,53 v1(29.21,54.27)
FMC_D1: length 56.6
  Top Layer w0.254: U16.86 30.11,53.5 v1(29.34,53.5) ; U23.4 42.29,7.28 v1(41.78,7.78)
  Inner1 w0.254: v1(41.78,7.78) 36.8,12.76 36.8,24.31 29.34,31.78 29.34,46.96 28.32,47.98 28.32,52.49 v1(29.34,53.5)
FMC_D2: length 48.1
  Top Layer w0.254: v2(23.24,38.9) 23.29,38.9 U16.114 ; U23.5 43.09,3.89 42.42,3.21 v1(41.66,3.21)
  Inner1 w0.254: v2(23.24,38.9) 23.24,38.52 25.27,36.49 25.27,34.33 35.74,23.86 35.74,9.64 41.66,3.72 v1(41.66,3.21)
FMC_D3: length 48.2
  Top Layer w0.254: U23.7 44.69,4.09 v1(43.94,3.34) ; U16.115 24,38.9 v1(24,38.77)
  Inner1 w0.254: v1(24,38.77) 24.38,38.77 28.19,34.96 28.19,31.91 36.09,24.01 36.09,9.79 42.55,3.34 v1(43.94,3.34)
FMC_D4: length 67.9
  Top Layer w0.254: v1(40.89,50.96) 41.72,50.96 U16.58 ; v1(59.82,14.01) 57.91,12.1 51.49,12.1 45.49,6.1 45.49,4.81
  Inner1 w0.254: v1(40.89,50.96) 43.05,50.96 44.07,49.95 44.07,46.31 59.82,30.56 v1(59.82,14.01)
FMC_D5: length 68.7
  Top Layer w0.254: 42.88,52.83 41.65,51.6 v1(40.26,51.6) ; v1(59.94,12.99) 58.65,11.7 52.95,11.7 47.09,5.84 U23.10
  Inner1 w0.254: v1(59.94,12.99) 60.4,13.44 60.4,30.48 44.45,46.43 44.45,50.2 43.05,51.6 v1(40.26,51.6)
FMC_D6: length 67.8
  Top Layer w0.254: U23.11 47.89,5.84 53.27,11.21 59.44,11.21 v1(60.2,11.97) ; v1(40.89,52.23) 41.58,52.23 42.52,53.18
  Inner1 w0.254: v1(40.89,52.23) 42.93,52.23 44.81,50.35 44.81,46.58 60.75,30.63 60.75,12.53 v1(60.2,11.97)
FMC_D7: length 68.5
  Top Layer w0.254: v1(59.94,10.71) 53.59,10.71 49.49,6.6 49.49,4.81 ; v1(40.39,52.87) 40.39,53.16 41.46,54.24
  Inner1 w0.254: v1(40.39,52.87) 42.93,52.87 45.16,50.63 45.16,46.95 61.11,31 61.11,11.87 v1(59.94,10.71)
FMC_D8: length 43.7
  Top Layer w0.254: v1(49.4,17.56) 49.49,17.47 49.49,16.09 ; v1(39.62,52.11) 39.62,53.11 41.11,54.59
  Inner1 w0.254: v1(49.4,17.56) 48.57,17.56 42.44,23.69 42.44,44.68 39.62,47.5 v1(39.62,52.11)
FMC_D9: length 43.4
  Top Layer w0.254: v1(38.86,52.49) 38.86,53.05 U16.65 ; U23.44 47.89,17.42 v1(47.62,17.69)
  Inner1 w0.254: v1(47.62,17.69) 42.09,23.23 42.09,44.53 38.86,47.76 v1(38.86,52.49)
FMC_D10: length 44
  Top Layer w0.254: U16.66 38.23,53.13 v1(38.23,53) ; v1(46.74,17.69) 47.09,17.33 U23.45
  Inner1 w0.254: v1(38.23,53) 37.97,52.74 37.97,48.14 41.73,44.39 41.73,22.62 46.67,17.69 v1(46.74,17.69)
FMC_D11: length 44.6
  Top Layer w0.254: v1(37.85,53.76) 38.15,53.76 40.05,55.65 ; 45.49,16.09 45.49,17.59 v1(45.72,17.82)
  Inner1 w0.254: v1(45.72,17.82) 45.27,17.82 41.38,21.71 41.38,44.24 37.47,48.15 37.47,53.38 v1(37.85,53.76)
FMC_D12: length 44.9
  Top Layer w0.254: v1(37.59,54.52) 38.21,54.52 39.69,56.01 ; v1(44.7,17.56) 44.7,17.67 44.69,17.68 U23.48
  Inner1 w0.254: v1(44.7,17.56) 41.02,21.25 41.02,44.09 36.96,48.15 36.96,53.89 v1(37.59,54.52)
FMC_D13: length 43.9
  Top Layer w0.254: v1(42.16,18.33) 42.16,18.07 43.09,17.14 U23.50 ; v2(35.69,52.87) 35.69,54.29 33.97,56.01
  Inner1 w0.254: v1(42.16,18.33) 41.78,18.33 40.67,19.44 40.67,43.94 35.69,48.92 v2(35.69,52.87)
FMC_D14: length 43.2
  Top Layer w0.254: 42.29,16.09 42.29,16.93 v1(41.4,17.82) ; v1(34.8,53) 34.67,53.12 34.67,54.6 33.61,55.65
  Inner1 w0.254: v1(41.4,17.82) 40.31,18.91 40.31,43.8 34.8,49.31 v1(34.8,53)
FMC_D15: length 42.5
  Top Layer w0.254: v1(40.39,17.94) 40.69,17.64 U23.53 ; v1(33.91,53.12) 34.16,53.38 34.16,54.4 U16.79
  Inner1 w0.254: v1(33.91,53.12) 33.91,49.69 39.95,43.65 39.95,18.38 v1(40.39,17.94)
FMC_NBL0: length 43.1
  Top Layer w0.254: U16.141 35.78,32.3 v1(36.07,32.3) ; U23.15 51.09,7.19 v1(52.71,8.8)
  Inner1 w0.254: v1(36.07,32.3) 39.6,28.76 39.6,17.08 41.4,15.28 51.05,15.28 52.71,13.63 v1(52.71,8.8)
FMC_NBL1: length 32.7
  Top Layer w0.254: U23.39 51.89,15.1 51.18,14.39 v1(50.67,14.39) ; v1(35.94,31.53) 35.72,31.53 U16.142
  Inner1 w0.254: v1(50.67,14.39) 41.79,14.39 39.24,16.93 39.24,28.23 v1(35.94,31.53)
FMC_SDCAS: length 48.1
  Top Layer w0.254: v1(33.4,35.72) 32.84,35.72 U16.132 ; v1(52.83,6.9) 52.69,6.75 U23.17
  Inner1 w0.254: v1(52.83,6.9) 52.01,7.71 52.01,13.36 51.62,13.75 41.53,13.75 38.86,16.42 38.86,26.33 33.12,32.07 33.12,35.44 v1(33.4,35.72)
FMC_SDCKE0: length 25.8
  Top Layer w0.254: 53.49,16.09 v1(53.49,17.69) ; v1(49.28,37.63) 49.28,38.58 U16.29
  Inner1 w0.254: v1(49.28,37.63) 53.49,33.41 v1(53.49,17.69)
FMC_SDCLK: length 60
  Top Layer w0.254: U23.38 52.69,14.88 49.53,11.72 v1(49.53,11.34) ; U16.93 29.21,49.45 29.21,48.42 v1(28.96,48.17)
  Inner1 w0.254: v1(28.96,48.17) 29.84,47.28 29.84,31.77 37.16,24.46 37.16,13.55 39.37,11.34 v1(49.53,11.34)
FMC_SDNE0: length 42.6
  Top Layer w0.254: U16.28 48.64,38.5 48.64,37.12 v1(48.77,36.99) ; v1(56.9,9.31) 54.29,6.7 U23.19
  Top Layer w0.508: U23.19 54.29,1.96 54.23,1.89
  Inner1 w0.254: v1(56.9,9.31) 55.75,10.45 55.75,14.39 52.91,17.23 52.91,33.36 49.28,36.99 v1(48.77,36.99)
FMC_SDNWE: length 38.8
  Top Layer w0.254: U16.26 48.01,37.73 v1(48.01,37.38) ; U23.16 51.89,7.17 54.79,10.07 v1(55.25,10.07)
  Inner1 w0.254: v1(55.25,10.07) 55.09,10.22 55.09,14.41 52.32,17.18 52.32,31.66 48.01,35.98 v1(48.01,37.38)
FMC_SDRAS: length 57
  Top Layer w0.254: v1(45.85,47.41) 45.59,47.66 45.59,48.47 46.41,49.29 ; v1(59.44,9.94) 59.31,10.07 56.39,10.07 53.49,7.17 53.49,4.81
  Inner1 w0.254: v1(45.85,47.41) 45.85,46.9 61.46,31.28 61.46,11.41 60,9.94 v1(59.44,9.94)
INPUT1: length 32.6
  Top Layer w0.254: v1(46.61,35.85) 46.36,35.6 45.89,35.6 U16.20
  Bottom Layer w0.254: v1(46.61,35.85) 48.13,35.85 54.86,29.12 72.04,29.12 U29.1
INPUT2: length 33.9
  Top Layer w0.254: v1(45.97,34.96) 45.82,34.96 44.64,36.14
  Bottom Layer w0.254: v1(45.97,34.96) 46.22,35.21 47.89,35.21 54.36,28.74 57.66,28.74 60.91,25.48 U29.3 73.47,25.69
INPUT3: length 34.5
  Top Layer w0.254: v1(45.97,34.07) 45.97,34.1 U16.18
  Bottom Layer w0.254: v1(45.97,34.07) 47.62,32.42 48.62,32.42 57.56,23.48 U29.5
INPUT4: length 42.1
  Top Layer w0.254: U16.5 38.77,32.12 38.77,32.45 v1(39.37,33.06)
  Bottom Layer w0.254: v1(39.37,33.06) 39.23,32.92 39.23,32.56 48.01,23.79 56.52,23.79 58.82,21.48 U29.7
INPUT5: length 44.5
  Top Layer w0.254: U16.4 38.23,31.95 38.23,33.06 v1(38.61,33.44)
  Bottom Layer w0.254: U29.9 60.18,19.48 56.24,23.43 47.86,23.43 38.61,32.68 v1(38.61,33.44)
INPUT6: length 48.7
  Top Layer w0.254: v1(38.61,34.33) 37.72,33.44 37.72,31.75 U16.3
  Bottom Layer w0.254: v1(38.61,34.33) 37.85,33.56 37.85,32.94 47.71,23.08 56.08,23.08 61.67,17.48 73.68,17.48
INPUT7: length 50.2
  Top Layer w0.254: U16.2 37.34,31.42 37.34,34.07 v1(37.72,34.45)
  Bottom Layer w0.254: v1(37.72,34.45) 37.46,34.19 37.46,32.82 47.56,22.72 55.93,22.72 63.17,15.48 73.68,15.48
INPUT8: length 49.6
  Top Layer w0.254: v1(36.7,33.31) 36.7,31.35 38.28,29.77
  Bottom Layer w0.254: 73.68,13.48 73.41,13.75 64.39,13.75 61.85,16.3 61.85,16.3 55.78,22.36 47.29,22.36 36.7,32.95 v1(36.7,33.31)
LED1: length 15.1
  Top Layer w0.254: U16.136 29.2,29.25 v1(28.83,29.25) ; v1(21.84,31.03) 21.53,31.34 R41.2
  Inner1 w0.254: v1(21.84,31.03) 27.05,31.03 v1(28.83,29.25)
LEDA: length 40.2
  Top Layer w0.254: FPC1.2 53.74,78.63 49.02,83.35 45.09,83.35 42.93,81.19 42.93,74.44 C72.1
  Top Layer w0.381: C72.1 40.62,72.14 D7.1 37.43,73.7 35.36,73.7 34.48,74.59 U10.5
LEDK: length 52.3
  Top Layer w0.254: FPC1.1 53.74,79.13 49.16,83.7 28.17,83.7 26.67,82.21 26.67,73.82 28.44,72.05 R29.2
  Top Layer w0.381: U10.3 29.4,72.05 R29.2
LTDC-B5: length 32.3
  Top Layer w0.254: U16.37 51.65,44.06 54.24,44.06 56.74,46.56 56.74,65.04 58.34,66.63 FPC1.26
LTDC_B3: length 57.1
  Top Layer w0.254: v1(33.4,38.01) 30.89,38.01 29.02,36.14 ; v2(56.13,46.77) 56.26,46.9 56.26,65.06 58.83,67.63 FPC1.24
  Bottom Layer w0.254: v1(33.4,38.01) 33.78,38.01 38.02,42.25 43.09,42.25 47.34,46.49 55.85,46.49 v2(56.13,46.77)
LTDC_B4: length 57.9
  Top Layer w0.254: 29.37,35.78 30.71,37.12 v1(33.66,37.12) ; v1(64.39,66.71) 63.97,67.13 FPC1.25
  Bottom Layer w0.254: v1(64.39,66.71) 64.9,66.2 64.9,54.39 56.64,46.14 47.48,46.14 43.24,41.9 38.81,41.9 34.04,37.12 v1(33.66,37.12)
LTDC_B6: length 57.9
  Top Layer w0.254: v2(34.54,33.18) 34.54,32.47 U16.139 ; FPC1.27 58.73,66.13 57.15,64.55 57.15,46.01 v2(57.66,45.5)
  Bottom Layer w0.254: v2(57.66,45.5) 57.38,45.78 47.63,45.78 43.39,41.54 38.96,41.54 34.54,37.13 v2(34.54,33.18)
LTDC_B7: length 58.8
  Top Layer w0.254: v2(35.18,34.2) 35.18,32.4 33.97,31.19 ; v2(58.55,44.74) 58.55,45.63 57.53,46.65 57.53,64.05 59.12,65.63 FPC1.28
  Bottom Layer w0.254: v2(35.18,34.2) 35.26,34.28 35.26,37.33 39.11,41.19 43.54,41.19 47.78,45.43 56.85,45.43 57.53,44.74 v2(58.55,44.74)
LTDC_CLK: length 45.7
  Top Layer w0.254: FPC1.30 60.27,64.63 v2(60.2,64.55) ; v1(29.84,48.17) 29.84,49.52 U16.92
  Bottom Layer w0.254: v2(60.2,64.55) 56.01,60.36 56.01,55.92 54.1,54.01 53.47,54.01 49.4,49.95 39.37,49.95 38.61,49.19 33.15,49.19 31.24,47.28 30.73,47.28 v1(29.84,48.17)
LTDC_DE: length 43.6
  Top Layer w0.254: v2(58.04,43.72) 58.42,43.72 59.13,44.44 59.13,54.32 58.24,55.21 58.24,61.15 59.72,62.63 FPC1.34 ; U16.22 44.58,38.33 v2(44.58,38.52)
  Bottom Layer w0.254: v2(44.58,38.52) 45.47,39.41 45.47,42.61 47.92,45.07 56.69,45.07 v2(58.04,43.72)
LTDC_DISP: length 92.1
  Top Layer w0.254: FPC1.31 64.35,64.13 66.68,66.46 v2(66.68,69.51) ; v2(24,49.82) 25.3,49.82 U16.98
  Bottom Layer w0.254: v2(66.68,69.51) 66.68,79.03 61.82,83.88 45.61,83.88 44.07,82.34 44.07,61.89 43.18,61 34.42,61 24,50.58 v2(24,49.82)
LTDC_G2: length 36.8
  Top Layer w0.254: FPC1.15 55.2,72.13 53.09,70.01 53.09,56.36 54.48,54.97 v2(54.48,51.47) ; v2(50.29,47.79) 49.86,47.79 48.89,46.82
  Bottom Layer w0.254: v2(54.48,51.47) 50.8,47.79 v2(50.29,47.79)
LTDC_G3: length 64.7
  Top Layer w0.254: FPC1.16 55.46,71.63 53.44,69.61 53.44,56.51 54.99,54.96 54.99,51.98 55.88,51.09 55.88,48.55 v2(55.63,48.3) ; v1(33.4,39.03) 31.2,39.03 U16.125
  Bottom Layer w0.254: v2(55.63,48.3) 55.63,47.15 55.32,46.85 47.19,46.85 42.95,42.61 36.98,42.61 v1(33.4,39.03)
LTDC_G4: length 38.4
  Top Layer w0.254: U16.69 41.06,58.08 v2(41.78,58.08) ; FPC1.17 56.36,71.13 54.1,68.87 v2(54.1,56.93)
  Bottom Layer w0.254: v2(54.1,56.93) 52.58,55.41 46.61,55.41 43.94,58.08 v2(41.78,58.08)
LTDC_G5: length 56.8
  Top Layer w0.254: v2(42.55,58.84) 41.11,58.84 U16.70 ; v2(65.02,70.78) 64.88,70.63 FPC1.18
  Bottom Layer w0.254: v2(65.02,70.78) 53.04,82.76 45.51,82.76 45.09,82.33 45.09,61.38 v2(42.55,58.84)
LTDC_G6: length 79.3
  Top Layer w0.254: v2(24.77,50.46) 25.38,50.46 U16.97 ; FPC1.19 65.9,70.13 v2(66.04,70.27)
  Bottom Layer w0.254: v2(24.77,50.46) 26.16,51.85 26.16,52.21 34.57,60.62 43.43,60.62 44.45,61.63 44.45,82.2 45.6,83.35 53.47,83.35 66.04,70.78 v2(66.04,70.27)
LTDC_G7: length 59.9
  Top Layer w0.254: v2(55.63,52.36) 55.63,55.03 54.74,55.92 54.74,67.98 56.38,69.63 FPC1.20 ; U16.117 26.94,40.42 v2(27.56,40.42)
  Bottom Layer w0.254: v2(55.63,52.36) 55.63,51.79 51.04,47.2 47.04,47.2 42.8,42.96 30.1,42.96 v2(27.56,40.42)
LTDC_HSYNC: length 92.1
  Top Layer w0.254: v2(67.56,67.98) 67.56,66.58 64.61,63.63 FPC1.32 ; 27.25,49.29 25.65,50.89 v2(25.65,53.12)
  Bottom Layer w0.254: v2(67.56,67.98) 67.56,78.78 62.1,84.24 45.47,84.24 43.71,82.49 43.71,70.8 43.69,70.77 43.69,62.01 43.05,61.38 33.91,61.38 v2(25.65,53.12)
LTDC_R3: length 40.3
  Top Layer w0.254: v2(49.02,49.31) 48.56,49.31 47.47,48.23 ; v2(52.2,51.85) 51.18,52.87 51.18,72.55 54.26,75.63 FPC1.8
  Bottom Layer w0.254: v2(49.02,49.31) 50.42,49.31 52.2,51.09 v2(52.2,51.85)
LTDC_R4: length 66.3
  Top Layer w0.254: v2(26.54,44.23) 26.54,45.05 U16.103 ; FPC1.9 54.26,75.13 51.56,72.43 51.56,53.76 v2(52.83,52.49)
  Bottom Layer w0.254: v2(52.83,52.49) 52.83,51.03 50.53,48.73 33.33,48.73 28.83,44.23 v2(26.54,44.23)
LTDC_R5: length 67.6
  Top Layer w0.254: FPC1.10 54.27,74.63 51.92,72.28 51.92,54.67 v2(53.47,53.12) ; U16.104 25.91,44.97 v2(25.91,43.6)
  Bottom Layer w0.254: v2(53.47,53.12) 53.72,52.87 53.72,51.34 50.75,48.37 33.48,48.37 28.7,43.6 v2(25.91,43.6)
LTDC_R6: length 39.7
  Top Layer w0.254: U16.47 48.48,49.95 50.55,49.95 51.69,51.09 52.39,51.09 54.05,52.75 54.05,53.62 52.3,55.37 52.3,72.16 54.27,74.13 FPC1.11
LTDC_R7: length 56.9
  Top Layer w0.254: v2(53.85,54.77) 53.4,54.77 52.65,55.52 52.65,72.01 54.27,73.63 FPC1.12 ; v1(30.48,48.93) 30.48,49.59 U16.91
  Bottom Layer w0.254: v2(53.85,54.77) 53.59,54.52 53.09,54.52 48.95,50.38 31.93,50.38 v1(30.48,48.93)
LTDC_VSYNC: length 27.4
  Top Layer w0.254: v2(58.29,50.2) 57.89,50.61 57.89,61.73 59.28,63.13 FPC1.33 ; U16.40 53.94,50.46 v2(55.25,50.46)
  Bottom Layer w0.254: v2(58.29,50.2) 58.04,50.46 v2(55.25,50.46)
OSC32_IN: length 11.9
  Top Layer w0.254: 42.55,24.97 42.55,30.46 U16.8 ; 42.55,24.97 42.55,24.67 42.9,24.32 32.768K1.2 ; 42.55,24.97 42.49,24.97 C70.1
OSC32_OUT: length 6.4
  Top Layer w0.254: R20.2 44.33,28.1 43.31,29.12 43.31,30.4 41.11,32.6
PA13/TMS: length 15
  Top Layer w0.254: 14.99,49.31 16.26,48.04 19.3,48.04 20.83,49.57 21.34,49.57 23.11,47.79 23.11,47.06 U16.105
  Top Layer w0.635: R22.2 14.78,49.44 LINK1.3
PA14/TCK: length 23
  Top Layer w0.254: v2(18.8,40.8) 19.18,41.19 22.04,41.19 23.01,42.15
  Top Layer w0.635: LINK1.4 15.04,51.98 R23.2
  Inner2 w0.254: LINK1.4 13.97,51.98 18.8,47.15 v2(18.8,40.8)
PH0_OSC_IN: length 15.9
  Top Layer w0.254: U16.23 47.2,36.41 47.2,35.56 46.61,34.96 46.61,33.56 48.08,32.1 49.59,32.1 50.16,31.52 50.16,28.48 50.83,27.82 X4.1
PH1_OSC_OUT: length 15.1
  Top Layer w0.254: U16.24 47.96,36.36 49.28,36.36 49.53,36.61 49.78,36.61 51.13,35.27 51.13,32.86 52.73,31.25 X4.2
PWR_4G: length 60.6
  Top Layer w0.254: U16.81 31.61,55.54 v1(30.99,55.54)
  Inner1 w0.254: v1(30.99,55.54) 29.09,55.54 25.6,52.05 25.6,44.68 24.92,44 24.92,41.97 15.49,32.54 15.49,26.96 18.97,23.48 U26.5
RESET: length 121.3
  Top Layer w0.254: v1(68.2,69.51) 69.53,69.51 69.66,69.63 ; U16.25 45.87,39.15 42.55,39.15 v1(39.12,35.72)
  Top Layer w0.635: 72.19,75.47 72.19,72.16 K2.1 69.66,69.63
  Inner2 w0.254: v1(68.2,69.51) 68.2,64.81 64.64,61.25 53.72,61.25 49.15,56.68 42.35,56.68 38.04,61 34.16,61 32.77,59.6 27.18,59.6 24.48,56.91 14.45,56.91 LINK1.5 12.95,54.52 18.54,48.93 25.91,48.93 v1(39.12,35.72)
RST_4G: length 66.6
  Top Layer w0.254: v1(31.5,56.3) 32.85,54.95 U16.80
  Inner1 w0.254: U26.6 19.33,2.85 20.57,4.1 20.57,23.02 16,27.6 16,32.55 25.27,41.82 25.27,43.85 25.96,44.54 25.96,51.9 28.96,54.9 31.62,54.9 32,55.28 32,55.79 v1(31.5,56.3)
SPI1_CS1: length 34.2
  Top Layer w0.254: FLASH1.1 26.29,22.77 v1(26.54,23.02) ; 47.47,38.97 46.27,40.17 v1(44.7,40.17)
  Bottom Layer w0.254: v1(44.7,40.17) 39.5,34.96 38.93,34.96 38.67,35.22 37.59,35.22 26.54,24.17 v1(26.54,23.02)
SPI1_MISO: length 15.7
  Top Layer w0.254: U16.134 27.18,28.64 27.18,25.44 25.78,24.04 FLASH1.2
SPI1_MOSI: length 42.8
  Top Layer w0.254: U16.43 36.71,35.34 34.42,35.34 v1(33.78,34.71) ; v1(14.73,27.34) 14.76,27.32 FLASH1.5
  Bottom Layer w0.254: v1(33.78,34.71) 32.64,34.71 27.05,29.12 16.76,29.12 14.99,27.34 v1(14.73,27.34)
SPI1_SCK: length 37.2
  Top Layer w0.254: 49.24,46.46 48.41,45.63 47.5,45.63 36.86,34.99 35.08,34.99 v2(33.91,33.82) ; v2(21.84,28.48) R19.2
  Bottom Layer w0.254: v2(21.84,28.48) 27.18,28.48 32.51,33.82 v2(33.91,33.82)
USART1_RX: length 42.3
  Top Layer w0.254: v2(24,48.3) 24,48.29 U16.102
  Inner2 w0.254: v2(24,48.3) 24,45.82 19.56,41.37 19.56,28.1 14.22,22.77 4.76,22.77 H1.1
USART1_TX: length 43.2
  Top Layer w0.254: v2(27.05,46.01) 26.99,46.01 U16.101
  Inner2 w0.254: v2(27.05,46.01) 24.7,46.01 19.91,41.23 19.91,25.16 16.34,21.58 H1.2
USART3_RX: length 70.3
  Top Layer w0.152: U16.112 22.61,39.63 v1(22.61,38.14)
  Inner2 w0.152: H1.5 4.6,16.55 21.08,16.55 22.38,17.84 22.38,37.91 v1(22.61,38.14)
  Bottom Layer w0.254: H1.5 2.16,16.17 2.16,15.53 3.94,13.75 14.35,13.75 21.97,6.13 U26.3
USART3_TX: length 63.7
  Top Layer w0.254: U16.111 22.57,40.3 v1(21.84,40.3)
  Inner2 w0.254: v1(21.84,40.3) 21.19,39.64 21.19,25.42 13.35,17.58 H1.6
  Bottom Layer w0.254: H1.6 13.57,17.58 23.37,7.78 23.37,4.25 U26.4
USART6_RX: length 42.5
  Top Layer w0.152: v1(26.92,35.09) 26.92,35.46 U16.124
  Inner2 w0.152: H1.7 4.5,14.65 20.07,14.65 24.66,19.23 24.66,32.82 v1(26.92,35.09)
USART6_TX: length 40.4
  Top Layer w0.254: U16.129 29.2,34.2 25.78,34.2 v1(24.13,32.55)
  Inner2 w0.254: H1.8 20.55,15.58 22.68,17.72 22.68,31.1 v1(24.13,32.55)
$1N34149: length 2.6
  Top Layer w0.254: LED2.1 19.7,33.28 19.69,33.27
$1N34157: length 2.2
  Top Layer w0.254: LED_P1.1 61.34,37.46 R11.1
$1N34166: length 3.1
  Top Layer w0.381: R8.2 33.78,70.83 U10.4
$1N34241: length 5.9
  Top Layer w0.254: 44.57,25.03 44.83,24.77 44.83,24.36 C71.1 ; 44.57,25.03 43.33,25.03 ; 44.57,25.03 R20.1
$1N34326: length 5.4
  Top Layer w0.635: R19.1 17.6,28.05 17.53,27.98 17.53,26.22 16.62,25.31 FLASH1.6
$1N34328: length 22.4
  Top Layer w0.381: D7.2 37.59,77.92 37.59,81.82 36.45,82.97 30.86,82.97 28.67,80.78 L7.1 30.99,78.11 U10.1
$1N34463: length 5.6
  Top Layer w0.254: U16.48 49.9,52.07 49.9,53.23
$1N34470: length 4.2
  Top Layer w0.254: 30.27,28.91 30.28,28.91 U16.138
$1N34473: length 4.8
  Top Layer w0.254: C86.1 41.94,60.38 U16.71
$1N34474: length 5.1
  Top Layer w0.254: R57.2 31.53,26.63 U16.143
$1N34492: length 3.8
  Top Layer w0.254: C85.1 21.26,48.2 U16.106
$1N170390: length 14
  Top Layer w0.762: F3.1 67.44,48.38 67.44,51.6 68.37,52.54 C67.2 72.09,52.54 C61.1 72.64,53.09 U24.2
$1N192193: length 24.8
  Top Layer w1.27: U27.2 17.48,63.23 L8.2 18.42,58.58 24.13,58.58 26.02,60.47 U28.1
$1N192492: length 31.6
  Top Layer w1.27: C131.1 19.3,73.32 20.83,71.79 20.83,68.7 U27.4 20.88,62.72 L8.1 23.24,62.4 23.24,64.93 25.73,67.43 F6.1
$1N195028: length 5.1
  Top Layer w1.2: F2.1 33.78,9.05 32.89,8.16

## Copper pours and planes (outline as drawn; the poured copper is in the pictures)
GND on Top Layer: -14.73,99.22 -14.73,-8.34 -16.13,-9.74 -12.7,-13.17 92.46,-13.17 92.46,94.53 87.76,99.22
GND on Bottom Layer: -16.13,97.7 -16.13,-8.47 -10.67,-13.93 90.81,-13.93 92.08,-12.66 92.08,95.41 89.79,97.7
GND on Inner1: -16.26,98.34 -16.26,-8.6 -15.24,-9.62 87.88,-9.62 92.96,-14.69 92.96,100.49 92.33,101.13 89.53,98.34
VCC on Top Layer: 62.61,40.17 67.69,40.17 67.94,39.91 67.94,34.2 67.18,33.44 62.87,33.44 62.61,33.69
VCC on Inner2: 25.78,26.71 25.91,26.58 25.91,24.67 29.08,24.67 30.48,23.28 31.23,23.28 35.34,27.38 28.74,27.38 28.06,26.7 28.06,26.71
VCC on Inner2: 38.33,2.38 38.33,-0.88 38.23,-0.98 66.17,-0.98 66.42,-0.72 66.42,32.93 67.18,33.69 63.88,33.69 63.5,33.31 63.5,3.33 62.93,2.76 38.7,2.76
VCC on Inner2: 45.09,21.63 45.09,20.24 45.08,20.23 63.59,20.23 63.95,19.87 63.95,21.44 64.14,21.63
VCC on Inner2: 16.89,55.79 17.2,55.48 17.2,50.98 20.96,47.22 20.96,41.19 19.18,39.41 29.28,29.3 31.31,29.3 33.55,27.07 39.6,27.07 41.53,28.99 47.62,28.99 50.68,32.05 53.14,32.05 53.77,32.68 67.82,32.68 67.82,41.31 67.69,41.44 58.29,41.44 56.01,43.72 56.01,47.03 46.61,56.42 41.78,56.42 37.21,61 35.4,61 34.01,59.6 29.34,59.6 25.79,56.05 17.78,56.05 17.52,55.79

## Text on the board
Bottom Silkscreen Layer: +5V | GND | 2024+ / 共创芯未来
Top Silkscreen Layer: U_3_RX | U_6_RX | U_1_RX | CAN_L | U_1_TX | CAN_H | U_3_TX | U_6_TX | 3_RX | 3_TX | GND | +5V | PA14/TCK | PA13/TMS | VCC | PWR | RST | RESET
